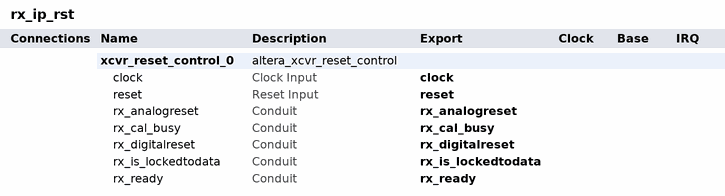
[diagram p0: system contents]
# Platform Designer (Qsys) system rx_ip_rst, Arria 10 10AX115N4F40I3SG
# Parameters at their usual value, and those the tool derives, are not listed.
package require -exact qsys 18.1
create_system rx_ip_rst
set_project_property DEVICE_FAMILY {Arria 10}
set_project_property DEVICE 10AX115N4F40I3SG

add_instance xcvr_reset_control_0 altera_xcvr_reset_control 18.1
set_instance_property xcvr_reset_control_0 AUTO_EXPORT true
set_instance_parameter_value xcvr_reset_control_0 CHANNELS 4
set_instance_parameter_value xcvr_reset_control_0 PLLS 4
set_instance_parameter_value xcvr_reset_control_0 RX_PER_CHANNEL 1
set_instance_parameter_value xcvr_reset_control_0 SYS_CLK_IN_MHZ 100
set_instance_parameter_value xcvr_reset_control_0 TX_ENABLE 0
set_instance_parameter_value xcvr_reset_control_0 TX_PLL_ENABLE 0
set_instance_parameter_value xcvr_reset_control_0 T_RX_ANALOGRESET 70000
set_instance_parameter_value xcvr_reset_control_0 T_TX_ANALOGRESET 70000
set_instance_parameter_value xcvr_reset_control_0 T_TX_DIGITALRESET 70000
set_instance_parameter_value xcvr_reset_control_0 gui_pll_cal_busy 0

# exported interfaces
add_interface clock clock sink
set_interface_property clock EXPORT_OF xcvr_reset_control_0.clock
add_interface reset reset sink
set_interface_property reset EXPORT_OF xcvr_reset_control_0.reset
add_interface rx_analogreset conduit end
set_interface_property rx_analogreset EXPORT_OF xcvr_reset_control_0.rx_analogreset
add_interface rx_cal_busy conduit end
set_interface_property rx_cal_busy EXPORT_OF xcvr_reset_control_0.rx_cal_busy
add_interface rx_digitalreset conduit end
set_interface_property rx_digitalreset EXPORT_OF xcvr_reset_control_0.rx_digitalreset
add_interface rx_is_lockedtodata conduit end
set_interface_property rx_is_lockedtodata EXPORT_OF xcvr_reset_control_0.rx_is_lockedtodata
add_interface rx_ready conduit end
set_interface_property rx_ready EXPORT_OF xcvr_reset_control_0.rx_ready

set_interconnect_requirement {$system} qsys_mm.clockCrossingAdapter HANDSHAKE
set_interconnect_requirement {$system} qsys_mm.insertDefaultSlave FALSE
set_interconnect_requirement {$system} qsys_mm.maxAdditionalLatency 1

save_system rx_ip_rst.qsys
